# EAGLE design io_bottom (EAGLE 9.6.2)
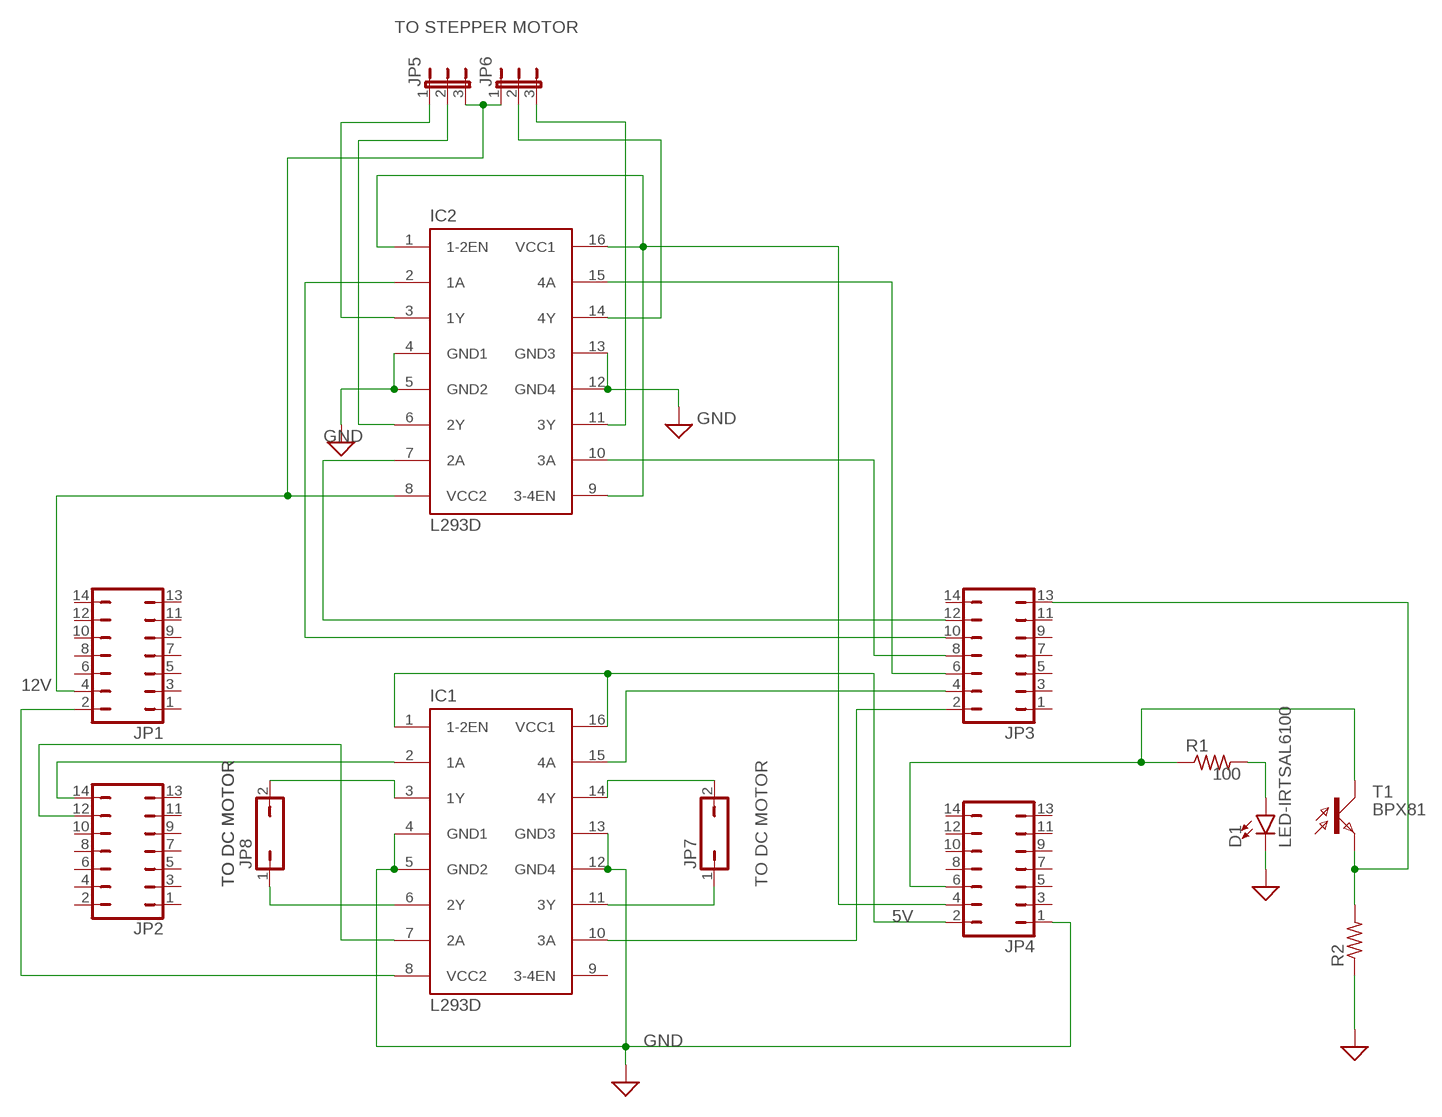
[diagram p0: schematic, sheet 1]

## Parts
D1  LED-IRTSAL6100  [LED_5MM]
IC1  L293D  [DIL16]
IC2  L293D  [DIL16]
JP1  JP7Q  [JP7Q]
JP2  JP7Q  [JP7Q]
JP3  JP7Q  [JP7Q]
JP4  JP7Q  [JP7Q]
JP5  JP2E  [JP2]
JP6  JP2E  [JP2]
JP7  JP1Q  [JP1]
JP8  JP1Q  [JP1]
R1  R-US_0204/2V  [0204V]
R2  R-US_0204/2V  [0204V]
T1  BPX81  [BPX81]

## Nets
5V: IC1.8(VCC2) JP1.2
GND: D1.K(C) IC1.4(GND1) IC1.5(GND2) IC1.12(GND4) IC1.13(GND3) IC2.4(GND1) IC2.5(GND2) IC2.12(GND4) IC2.13(GND3) JP4.1 R2.1 ; supply symbol labelled SUP
N$1: IC1.3(1Y) JP8.2
N$2: IC1.6(2Y) JP8.1
N$3: IC1.11(3Y) JP7.1
N$4: IC1.14(4Y) JP7.2
N$5: IC1.2(1A) JP2.14
N$6: IC1.7(2A) JP2.12
N$7: IC1.1(1-2EN) IC1.16(VCC1) JP4.2
N$8: IC1.15(4A) JP3.4
N$9: IC1.10(3A) JP3.2
N$10: IC2.15(4A) JP3.6
N$11: IC2.10(3A) JP3.8
N$12: IC2.2(1A) JP3.10
N$13: IC2.7(2A) JP3.12
N$14: IC2.1(1-2EN) IC2.9(3-4EN) IC2.16(VCC1) JP4.4
N$15: IC2.6(2Y) JP5.2
N$16: IC2.3(1Y) JP5.1
N$17: IC2.11(3Y) JP6.3
N$18: IC2.8(VCC2) JP1.4 JP5.3 JP6.1
N$19: IC2.14(4Y) JP6.2
N$20: D1.A R1.2
N$21: JP3.13 R2.2 T1.E
N$22: JP4.6 R1.1 T1.C
Unconnected: IC1.9(3-4EN) JP1.1 JP1.3 JP1.5 JP1.6 JP1.7 JP1.8 JP1.9 JP1.10 JP1.11 JP1.12 JP1.13 JP1.14 JP2.1 JP2.2 JP2.3 JP2.4 JP2.5 JP2.6 JP2.7 JP2.8 JP2.9 JP2.10 JP2.11 JP2.13 JP3.1 JP3.3 JP3.5 JP3.7 JP3.9 JP3.11 JP3.14 JP4.3 JP4.5 JP4.7 JP4.8 JP4.9 JP4.10 JP4.11 JP4.12 JP4.13 JP4.14

## Notes on the sheet
- TO STEPPER MOTOR
- GND
- GND
- 12V
- 100
- TO DC MOTOR | TO DC MOTOR | TO DC MOTOR
- GND

## Library data of the parts
D1 = SparkFun-LED:LED-IR: Infrared LED (IR) Wavelength: 940nm Packages: TSAL6100 LTE302 - Side firing. Check SparkFun-Sensors.lbr for the receiver SparkFun Products: ZX Distance and Gesture Sensor <[https://www.sparkfun.com/products/12780]> Infrared Emitters and Detectors <https://www.sparkfun.com/products/241>; PROD_ID: DIO-12058
IC1 IC2 = st-microelectronics:L293D: PUSH-PULL 4 CHANNEL DRIVER; MPN: L293D; OC_FARNELL: 9589619; OC_NEWARK: 56P8249
JP1-JP4 = jumper:JP7Q: JUMPER
JP5 JP6 = jumper:JP2E: JUMPER
JP7 JP8 = jumper:JP1Q: JUMPER
R1 R2 = rcl:R-US_: RESISTOR, American symbol; SPICEPREFIX: R
T1 = opto-trans-siemens:BPX81: PHOTO TRANSISTOR; OC_FARNELL: unknown; OC_NEWARK: unknown

## Board
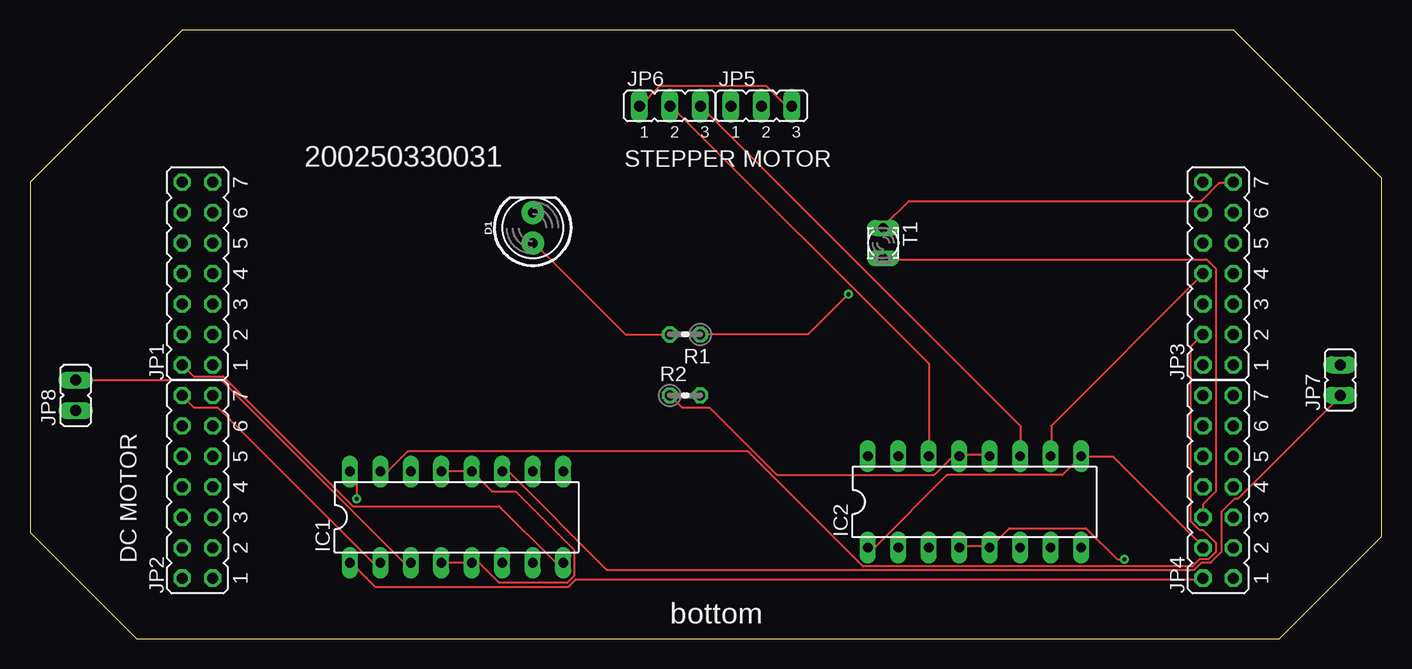
[diagram p1: board, top side]
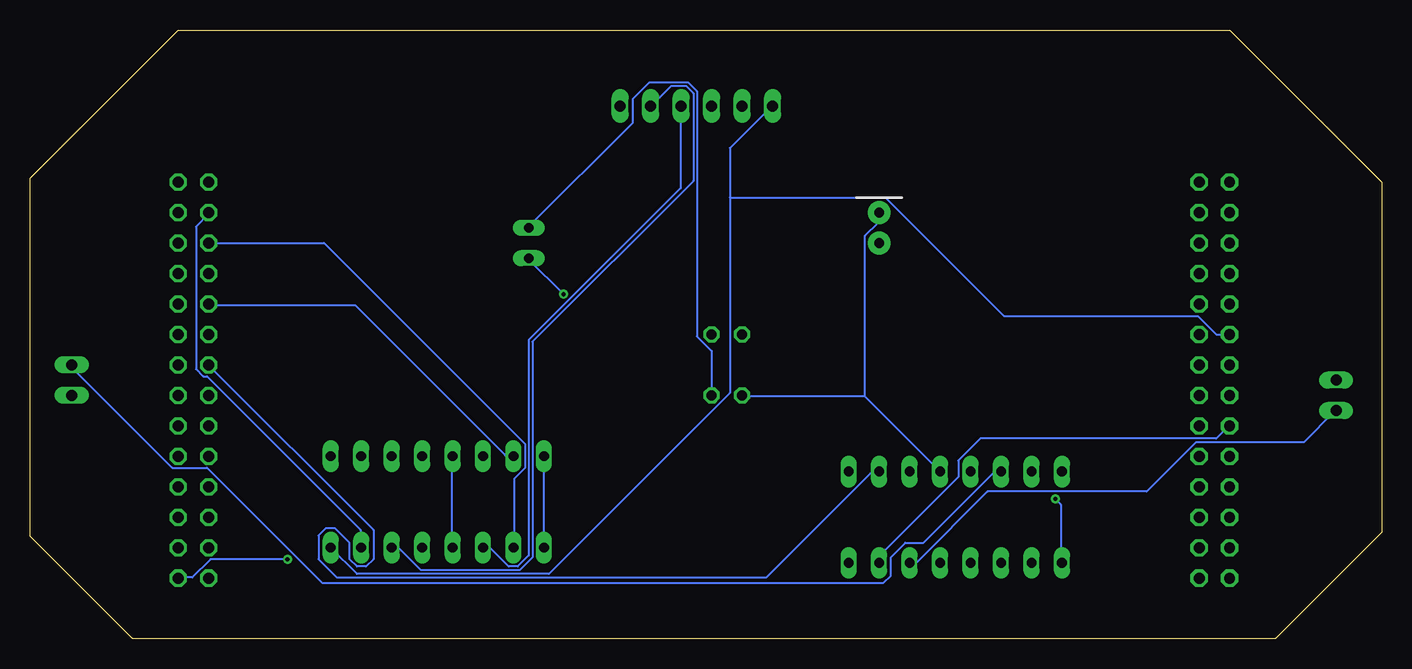
[diagram p2: board, bottom side, seen from below]

Size 112.7 x 50.79 mm. Coordinates in mm from the lower left corner, seen from the top.
Outline: 0,38.1 0,8.89 8.89,0 104.14,0 112.7,8.56 112.7,38.43 100.34,50.79 12.69,50.79 0,38.1
Copper layers (1*16): Top 0.035mm / dielectric 1.5mm / Bottom 0.035mm
Design rules "default": minimum track width 6mil, minimum drill 0.35mm, track to track 6mil, track to pad 6mil, pad to pad 6mil, via to via 6mil, smd to smd 6mil, copper to edge 40mil, drill to drill 6mil, minimum pad ring 10mil, minimum via ring 8mil, stop-mask expansion 4mil, vias tented up to drill 0mil, thermal gap 10mil

### Footprints (pad centres in the part's own frame; a part is rotated, then mirrored left to right if it is on the bottom)
LED_5MM = drill 0.813 pad 1.88: A -1.27,0; K 1.27,0
DIL16 = drill 0.813 long: 1 -8.89,-3.81; 2 -6.35,-3.81; 3 -3.81,-3.81; 4 -1.27,-3.81; 5 1.27,-3.81; 6 3.81,-3.81; 7 6.35,-3.81; 8 8.89,-3.81; 9 8.89,3.81; 10 6.35,3.81; 11 3.81,3.81; 12 1.27,3.81; 13 -1.27,3.81; 14 -3.81,3.81; 15 -6.35,3.81; 16 -8.89,3.81
JP7Q = drill 0.914 octagon: 1 -7.62,-1.27; 2 -7.62,1.27; 3 -5.08,-1.27; 4 -5.08,1.27; 5 -2.54,-1.27; 6 -2.54,1.27; 7 0,-1.27; 8 0,1.27; 9 2.54,-1.27; 10 2.54,1.27; 11 5.08,-1.27; 12 5.08,1.27; 13 7.62,-1.27; 14 7.62,1.27
JP2 = drill 0.914 long: 1 -2.54,0; 2 0,0; 3 2.54,0
JP1 = drill 0.914 long: 1 0,-1.27; 2 0,1.27
0204V = drill 0.813 octagon: 1 -1.27,0; 2 1.27,0
BPX81 = drill 0.813 long: C 1.27,0; E -1.27,0

### Placement (x,y rotation side)
D1  41.91,34.29 90 top
IC1  35.56,10.16 0 top
IC2  78.74,11.43 0 top
JP1  13.97,30.48 90 top
JP2  13.97,12.7 90 top
JP3  99.06,30.48 90 top
JP4  99.06,12.7 90 top
JP5  60.96,44.45 0 top
JP6  53.34,44.45 0 top
JP7  109.22,21.59 0 top
JP8  3.81,20.32 0 top
R1  54.61,25.4 180 top
R2  54.61,20.32 0 top
T1  71.12,33.02 270 top

### Tracks (layer width: path | path; a pad name or v marks a point on that pad's centre or on a via)
5V
  Top 0.152: IC1.8 43.84,6.35 39.12,11.07 26.92,11.07 16.1,21.89 13.67,21.89 JP1.2
GND  (via drill 0.35)
  Top 0.152: IC2.12 79.96,15.34 77.52,15.34 IC2.13 77.37,15.19 76.91,15.19 75.39,13.67 62.28,13.67 56.64,19.3 54.36,19.3 R2.1 | IC2.4 77.52,7.72 79.96,7.72 IC2.5 81.64,9.25 88.04,9.25 90.63,6.66 v91.24,6.66 | IC1.4 IC1.5 37.44,6.35 39.12,4.67 44.76,4.67 45.36,5.28 45.36,7.42 40.49,12.29 38.51,12.29 IC1.12 IC1.13
  Bottom 0.152: v91.24,6.66 97.64,6.66 99.16,5.13 100.23,5.13 JP4.1 | IC2.13 77.52,15.19 77.52,7.72 IC2.4 | 43.08,20.22 53.29,20.22 R2.1 | IC1.12 43.08,20.22 | 43.08,20.22 43.08,33.63 42.01,34.7 42.01,35.46 D1.K
N$1
  Top 0.152: IC1.3 31.19,6.35 15.95,21.59 JP8.2
N$2
  Bottom 0.152: IC1.6 38.81,6.35 32.87,12.29 19.61,12.29 15.49,16.41 6.5,16.41 3.91,19 JP8.1
N$3
  Top 0.152: IC1.11 39.88,13.97 48.11,5.74 97.03,5.74 97.64,6.35 98.4,6.35 99.31,7.26 99.31,10.62 100.38,11.68 100.69,11.68 109.22,20.22 JP7.1
N$4
  Bottom 0.152: IC1.14 32.26,13.97 38.2,8.03 39.73,8.03 40.95,6.81 40.95,5.28 41.55,4.67 88.34,4.67 97.94,14.28 100.84,14.28 109.22,22.66 JP7.2
N$5
  Top 0.152: IC1.2 28.6,6.35 15.65,19.3 13.67,19.3 12.75,20.22 JP2.14
N$6
  Bottom 0.152: IC1.7 41.86,6.35 41.86,6.96 35.31,13.51 35.31,14.88 33.48,16.71 13.82,16.71 12.75,17.78 JP2.12
N$7  (via drill 0.35)
  Top 0.152: v27.23,11.68 27.23,13.51 26.77,13.97 IC1.16 | JP4.2 97.79,4.98 45.52,4.98 44.91,4.37 28.75,4.37 26.77,6.35 IC1.1
  Bottom 0.152: v27.23,11.68 26.77,11.23 26.77,6.35 IC1.1
N$8
  Top 0.152: IC1.15 29.82,13.97 31.5,15.65 59.84,15.65 69.44,6.05 96.88,6.05 97.48,6.66 98.25,6.66 98.86,7.26 98.86,8.03 97.79,9.09 97.48,9.09 96.72,9.86 96.72,24.33 JP3.4
N$9
  Bottom 0.152: IC1.10 42.47,13.97 51.31,5.13 87.12,5.13 88.65,6.66 88.65,8.64 88.04,9.25 87.27,9.25 86.06,8.03 86.06,6.66 85.45,6.05 84.68,6.05 84.07,6.66 84.07,9.09 97.79,22.81 JP3.2
N$10
  Bottom 0.152: IC2.15 72.49,15.34 73.1,15.34 85.6,27.84 97.79,27.84 JP3.6
N$11
  Top 0.152: IC2.10 85.14,15.34 85.14,17.78 97.79,30.43 JP3.8
N$12
  Bottom 0.152: JP3.10 88.19,33.02 71.42,16.26 71.42,14.28 72.34,13.36 72.34,7.72 IC2.2
N$13
  Bottom 0.152: IC2.7 85.14,7.72 85.14,9.09 97.94,21.89 98.25,21.89 98.86,22.5 98.86,34.39 97.79,35.46 JP3.12
N$14
  Top 0.152: JP4.4 97.79,7.72 90.32,15.19 87.73,15.19 IC2.9 86.06,13.67 76.45,13.67 70.51,7.72 69.9,7.72 IC2.1
  Bottom 0.152: IC2.1 69.9,7.72 69.9,15.19 IC2.16
N$15
  Bottom 0.152: IC2.6 82.55,7.57 81.94,7.57 80.11,5.74 71.88,5.74 70.81,6.81 70.81,24.79 57.4,38.2 57.4,45.52 58.01,46.13 59.23,46.13 60.91,44.45 JP5.2
N$16
  Bottom 0.152: IC2.3 74.93,7.57 74.32,7.57 72.8,6.05 72.03,6.05 71.12,6.96 71.12,24.94 58.47,37.59 58.47,44.45 JP5.1
N$17
  Top 0.152: IC2.11 82.55,17.78 JP6.3
N$18
  Top 0.152: JP5.3 63.04,44.45 61.37,46.13 52.53,46.13 50.85,44.45 JP6.1
  Bottom 0.152: IC2.8 85.45,5.44 69.44,5.44 54.36,20.52 54.36,36.83 | 54.36,36.83 54.36,40.95 50.85,44.45 JP6.1 | JP1.4 13.82,25.4 15.34,26.92 31.5,26.92 41.4,36.83 54.36,36.83
N$19
  Top 0.152: IC2.14 74.93,22.96 53.44,44.45 JP6.2
N$20
  Top 0.152: R1.2 49.63,25.4 42.01,33.02 D1.A
N$21
  Top 0.152: JP3.13 100.23,38.05 99.16,38.05 97.64,36.53 73.25,36.53 71.12,34.39 T1.E
  Bottom 0.152: R2.2 55.88,24.03 57.1,25.25 57.1,45.67 57.86,46.43 61.06,46.43 62.43,45.06 62.43,43.08 71.12,34.39 T1.E
N$22  (via drill 0.35)
  Top 0.152: R1.1 64.87,25.4 v68.22,28.75 | JP4.6 97.79,11.23 98.86,12.29 98.86,30.89 98.09,31.65 71.12,31.65 T1.C
  Bottom 0.152: v68.22,28.75 71.12,31.65 T1.C

### Text on the board
tNames: 200250330031 | STEPPER MOTOR | DC MOTOR | bottom